# Altium project InsaneKeyboardRight.PrjPcb (part 2 of 3)
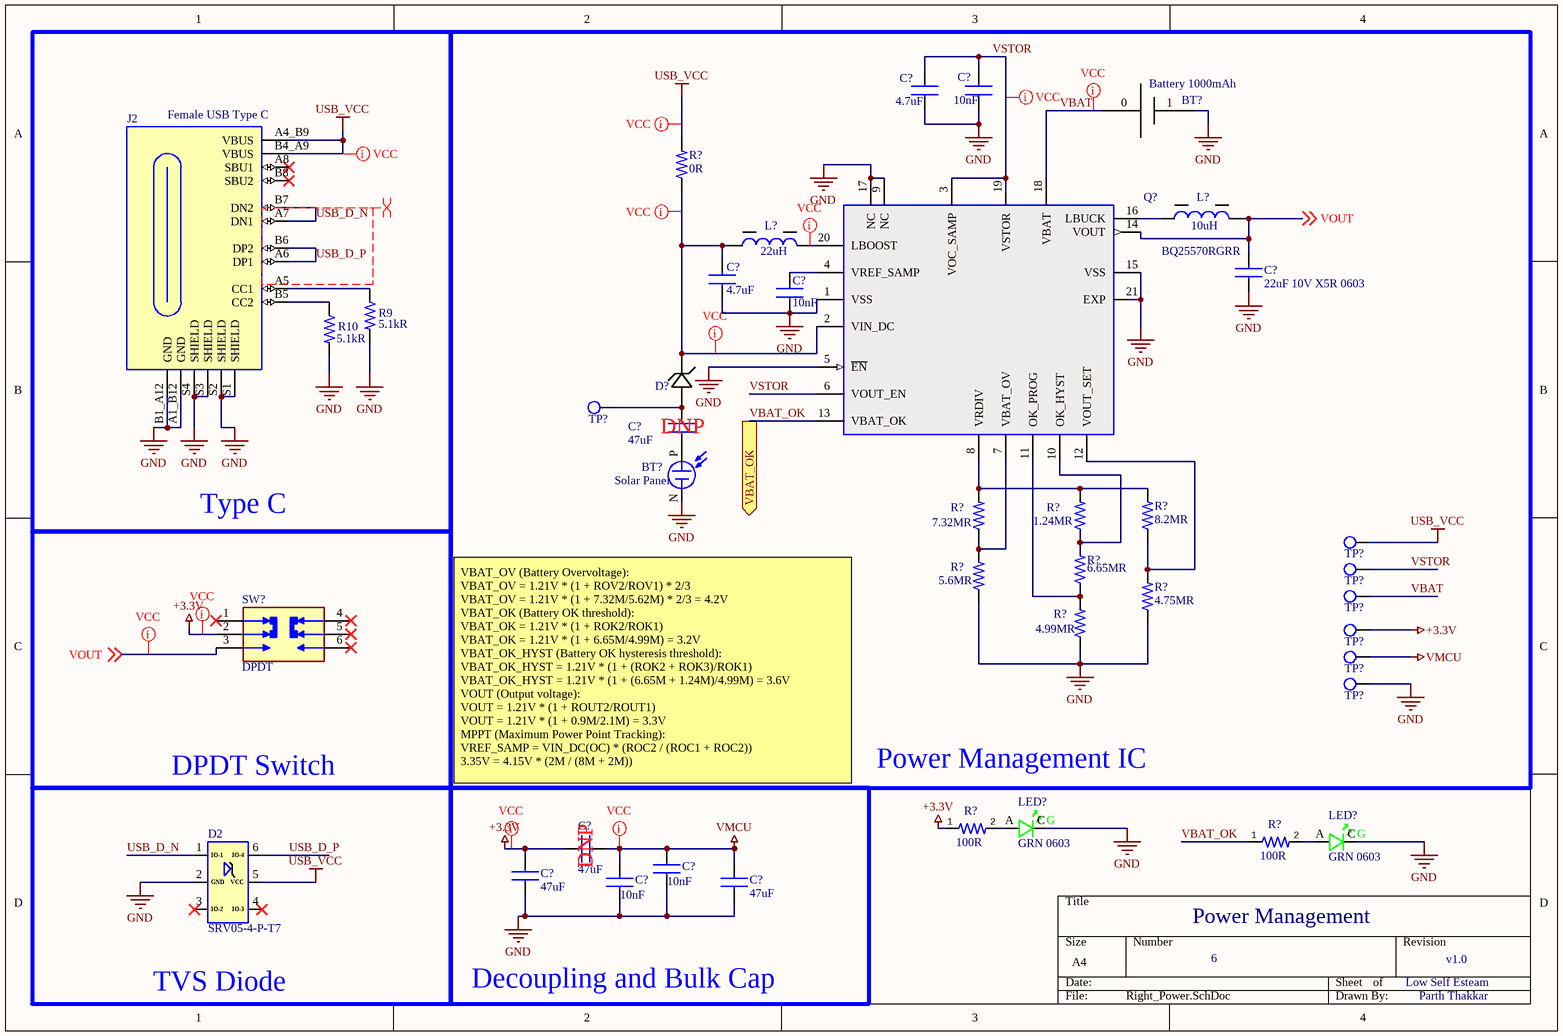
[diagram p5: Right_Power.SchDoc]

## Sheet Right_Power.SchDoc: Power Management (continued)
### Library data of the parts
BT?#1 = Battery 1000mAh: Batt Lith-ion 3.7V 1.05AH 404852; pin to pad: 0>1 1>3; Manufacturer: GlobTek; Manufacturer Part Number: BL1200P4054481S1PCAC; Supplier: Digikey; Supplier Part Number: 1939-BL1200P4054481S1PCAC-ND; RoHS: No; Category: Batteries and Accessories; Stock: 781; Pricing: 1=10.53, 10=9.312 (USD); ComponentLink1URL: https://www.globtek.com/pdf/manual-datasheets/BL1200P4054481S1PCAC.pdf?src-supplier=Digikey; ComponentLink1Description: https://www.globtek.com/pdf/manual-datasheets/BL1200P4054481S1PCAC.pdf?src-supplier=Digikey
BT?#2 = Solar Panel: Monocryst Solar Cell 184MW 4.15V; Manufacturer: ANYSOLAR; Manufacturer Part Number: SM141K06L; Supplier: Digikey; Supplier Part Number: SM141K06L-ND; RoHS: No; Stock: 2115; Pricing: 1=6.3, 25=4.9996, 50=4.7572, 100=4.545, 250=4.242, 500=4.0299 (USD)
C?#1 C?#4 = CAP 4.7uF 25V 0603: Ceramic Capacitor, Multilayer, Ceramic, 25V, 10% +Tol, 10% -Tol, X5R, 15% TC, 4.7uF, Surface Mount, 0603; Manufacturer: Murata; Manufacturer Part Number: GRT188R61E475KE13D; Multilayer: Yes; Reference Standard: AEC-Q200; Supplier: Digikey; Supplier Part Number: 490-12328-1-ND; RoHS: Yes; Category: Ceramic Capacitors; Stock: 959263; Pricing: 1=0.19, 10=0.111, 50=0.0792, 100=0.0693, 500=0.05246, 1000=0.04721 (USD); Mounting Technology: Surface Mount; Pins: 2; Dielectric Material: Ceramic; Package Shape: Rectangular; Case/Package: 0603; Terminal Finish: Nickel; Min Operating Temperature: -55°C; Max Operating Temperature: 85°C; JESD-609 Code: e3; Capacitor Type: Ceramic; Tolerance  (fill in as +-): 10%; Packaging: Tape and Reel; Tolerance (fill in as +-): 10%; Rated DC Voltage (URdc): 25V; Temperature Characteristics Code: X5R; Termination: Wraparound; Reach SVHC Compliant: Yes; RoHS Compliant: Yes; ComponentLink1URL: https://psearch.en.murata.com:443/capacitor/product/GRT188R61E475KE13%23.pdf?src-supplier=IHS+Markit; ComponentLink1Description: https://psearch.en.murata.com:443/capacitor/product/GRT188R61E475KE13%23.pdf?src-supplier=IHS+Markit; ComponentLink2URL: http://www.farnell.com/datasheets/2165958.pdf?src-supplier=Farnell; ComponentLink2Description: http://www.farnell.com/datasheets/2165958.pdf?src-supplier=Farnell; ComponentLink3URL: http://search.murata.co.jp/Ceramy/image/img/A01X/G101/ENG/GRT188R61E475KE13-01.pdf?src-supplier=Digikey; ComponentLink3Description: http://search.murata.co.jp/Ceramy/image/img/A01X/G101/ENG/GRT188R61E475KE13-01.pdf?src-supplier=Digikey; ComponentLink4URL: https://datasheet.octopart.com/GRT188R61E475KE13D-Murata-datasheet-67697750.pdf?src-supplier=Newark; ComponentLink4Description: https://datasheet.octopart.com/GRT188R61E475KE13D-Murata-datasheet-67697750.pdf?src-supplier=Newark; ComponentLink5URL: http://www.farnell.com/datasheets/2165958.pdf?src-supplier=Element14; ComponentLink5Description: http://www.farnell.com/datasheets/2165958.pdf?src-supplier=Element14; ComponentLink6URL: https://datasheet.octopart.com/GRT188R61E475KE13D-Murata-datasheet-165579666.pdf?src-supplier=TME; ComponentLink6Description: https://datasheet.octopart.com/GRT188R61E475KE13D-Murata-datasheet-165579666.pdf?src-supplier=TME
C?#2 C?#5 = CAP 10nF 100V 0603: Ceramic Capacitor, Multilayer, Ceramic, 100V, 10% +Tol, 10% -Tol, X7R, 15% TC, 0.01uF, Surface Mount, 0603; Manufacturer: Murata; Manufacturer Part Number: GCM188R72A103KA37D; Multilayer: Yes; Reference Standard: AEC-Q200; Supplier: Digikey; Supplier Part Number: 490-4781-1-ND; RoHS: Yes; Category: Ceramic Capacitors; Stock: 6259212; Pricing: 1=0.1, 10=0.03, 50=0.0204, 100=0.0174, 500=0.0125, 1000=0.01097, 4000=0.00978, 8000=0.00881, 12000=0.00833, 20000=0.00779, 28000=0.00747, 40000=0.00716, 100000=0.0065, 200000=0.00638 (USD); Mounting Technology: Surface Mount; Pins: 2; Dielectric Material: Ceramic; Package Shape: Rectangular; Case/Package: 0603; Terminal Finish: Nickel; Min Operating Temperature: -55°C; Max Operating Temperature: 125°C; JESD-609 Code: e3; Capacitor Type: Ceramic; Tolerance  (fill in as +-): 10%; Package Style: SMTMeter; Packaging: Tape and Reel; Tolerance (fill in as +-): 10%; Rated DC Voltage (URdc): 100V; Temperature Characteristics Code: X7R; Termination: Wraparound; Length: 1.6mm; Width: 0.8mm; Height: 0.9mm; Reach SVHC Compliant: Yes; RoHS Compliant: Yes; ComponentLink1URL: https://psearch.en.murata.com:443/capacitor/product/GCM188R72A103KA37%23.pdf?src-supplier=IHS+Markit; ComponentLink1Description: https://psearch.en.murata.com:443/capacitor/product/GCM188R72A103KA37%23.pdf?src-supplier=IHS+Markit; ComponentLink2URL: https://datasheet.ciiva.com/132/product-132907.pdf?src-supplier=Digikey; ComponentLink2Description: https://datasheet.ciiva.com/132/product-132907.pdf?src-supplier=Digikey; ComponentLink3URL: https://datasheet.ciiva.com/132/product-132908.pdf?src-supplier=Digikey; ComponentLink3Description: https://datasheet.ciiva.com/132/product-132908.pdf?src-supplier=Digikey; ComponentLink4URL: https://datasheet.ciiva.com/132/product-132909.pdf?src-supplier=Digikey; ComponentLink4Description: https://datasheet.ciiva.com/132/product-132909.pdf?src-supplier=Digikey; ComponentLink5URL: https://datasheet.ciiva.com/11786/0900766b80ef92d0-11786108.pdf?src-supplier=Rs; ComponentLink5Description: https://datasheet.ciiva.com/11786/0900766b80ef92d0-11786108.pdf?src-supplier=Rs; ComponentLink6URL: https://datasheet.ciiva.com/16497/product-16497251.pdf?src-supplier=Future+Electronics; ComponentLink6Description: https://datasheet.ciiva.com/16497/product-16497251.pdf?src-supplier=Future+Electronics; ComponentLink7URL: https://datasheet.ciiva.com/18183/getdatasheetpartid-178890-18183651.pdf?src-supplier=Verical; ComponentLink7Description: https://datasheet.ciiva.com/18183/getdatasheetpartid-178890-18183651.pdf?src-supplier=Verical; ComponentLink8URL: https://datasheet.ciiva.com/11619/product-11619719.pdf?src-supplier=Avnet; ComponentLink8Description: https://datasheet.ciiva.com/11619/product-11619719.pdf?src-supplier=Avnet
C?#3 = CAP 22uF 6.3V 0603: Ceramic Capacitor, Multilayer, Ceramic, 6.3V, 20% +Tol, 20% -Tol, X5R, 15% TC, 22uF, Surface Mount, 0603; Manufacturer: Murata; Manufacturer Part Number: GRM188R61A226ME15D; Voltage Rating DC: 10 VDC; Brand: Murata Electronics; Type: Voltage and Temperature Derating Recommended Product; Unit Weight: 0.000222 oz; Multilayer: Yes; Supplier 1: Digi-Key; Supplier Part Number 1: 490-10476-1-ND; Stock 1: 849458; Pricing 1: 1=0.33, 10=0.226, 50=0.1506, 100=0.1279, 500=0.0903, 1000=0.079 (USD); Product Category: Multilayer Ceramic Capacitors MLCC - SMD/SMT; RoHS: True; Capacitance: 22 uF; Dielectric: X5R; Tolerance: 20 %; Case Code - in: 0603; Case Code - mm: 1608; Height: 0.8 mm; Maximum Operating Temperature: + 85 C; Minimum Operating Temperature: - 55 C; Product: General Type MLCCs; Series: GRM; Packaging: Reel; Length: 1.6 mm; Package / Case: 0603 (1608 metric); Factory Pack Quantity: 4000; Termination Style: SMD/SMT; Width: 0.8 mm; ComponentLink1URL: http://www.farnell.com/datasheets/2047978.pdf?src-supplier=Element14; ComponentLink1Description: http://www.farnell.com/datasheets/2047978.pdf?src-supplier=Element14; Supplier: Digikey; Supplier Part Number: 490-7612-2-ND; Category: Ceramic Capacitors; Stock: 350000; Pricing: 10000=0.03357, 20000=0.03118, 30000=0.02998, 50000=0.02865, 70000=0.02786, 100000=0.0271, 250000=0.02546 (USD); Mounting Technology: Surface Mount; Pins: 2; Dielectric Material: Ceramic; Package Shape: Rectangular; Case/Package: 0603; Terminal Finish: Nickel; Min Operating Temperature: -55°C; Max Operating Temperature: 85°C; JESD-609 Code: e3; Value: 22uF; Capacitor Type: Ceramic; Tolerance  (fill in as +-): 20%; Package Style: SMTMeter; Tolerance (fill in as +-): 20%; Rated DC Voltage (URdc): 6.3V; Temperature Characteristics Code: X5R; Termination: Wraparound; Reach SVHC Compliant: Yes; RoHS Compliant: Yes; ComponentLink2URL: https://datasheet.ciiva.com:443/pdfs/VipMasterIC/IC/MURE/MURE-S-A0004349797/MURE-S-A0004352371-1.pdf?src-supplier=IHS+Markit; ComponentLink2Description: https://datasheet.ciiva.com:443/pdfs/VipMasterIC/IC/MURE/MURE-S-A0004349797/MURE-S-A0004352371-1.pdf?src-supplier=IHS+Markit; ComponentLink3URL: https://datasheet.ciiva.com/29541/partnumbering-e-01-29541598.pdf?src-supplier=Digikey; ComponentLink3Description: https://datasheet.ciiva.com/29541/partnumbering-e-01-29541598.pdf?src-supplier=Digikey
C?#6 C?#7 C?#9 C?#11 = CAP 47uF 10V 0805: Multilayer Ceramic Capacitors MLCC - SMD/SMT 0805 47uF 10volts *Derate Voltage/Temp; Manufacturer: Murata; Manufacturer Part Number: GRM21BR61A476ME15K; Tolerance: 20%; Dielectric: X5R; Supplier: Digikey; Supplier Part Number: 490-GRM21BR61A476ME15KCT-ND; RoHS: Yes; Category: Ceramic Capacitors; Mounting Technology: Surface Mount; Case/Package: 0805; Case Code (Imperial): 0805; Case Code (Metric): 2012; Weight: 0.000335oz; Material: Ceramic; Min Operating Temperature: -55°C; Max Operating Temperature: 85°C; Packaging: Tape and Reel; Voltage Rating: 10V; Termination: SMD/SMT; Voltage Rating (DC): 10V; Package Quantity: 10000; Series: GRM; Height: 1.45mm; RoHS Compliant: Yes; ComponentLink1URL: http://www.mouser.com/ds/2/281/c02e-2905.pdf?src-supplier=Mouser; ComponentLink1Description: http://www.mouser.com/ds/2/281/c02e-2905.pdf?src-supplier=Mouser; ComponentLink2URL: https://www.murata.com/~/media/webrenewal/support/library/catalog/products/capacitor/mlcc/c02e.ashx?la=en-us&src-supplier=Digikey; ComponentLink2Description: https://www.murata.com/~/media/webrenewal/support/library/catalog/products/capacitor/mlcc/c02e.ashx?la=en-us&src-supplier=Digikey; ComponentLink3URL: http://psearch.en.murata.com/capacitor/product/GRM21BR61A476ME15%23.pdf?src-supplier=Avnet; ComponentLink3Description: http://psearch.en.murata.com/capacitor/product/GRM21BR61A476ME15%23.pdf?src-supplier=Avnet; ComponentLink4URL: https://datasheet.octopart.com/GRM21BR61A476ME15K-Murata-datasheet-155345080.pdf?src-supplier=Newark; ComponentLink4Description: https://datasheet.octopart.com/GRM21BR61A476ME15K-Murata-datasheet-155345080.pdf?src-supplier=Newark; ComponentLink5URL: https://datasheet.octopart.com/GRM21BR61A476ME15K-Murata-datasheet-141278181.pdf?src-supplier=Future+Electronics; ComponentLink5Description: https://datasheet.octopart.com/GRM21BR61A476ME15K-Murata-datasheet-141278181.pdf?src-supplier=Future+Electronics; ComponentLink6URL: https://datasheet.octopart.com/GRM21BR61A476ME15K-Murata-datasheet-155345080.pdf?src-supplier=Element14; ComponentLink6Description: https://datasheet.octopart.com/GRM21BR61A476ME15K-Murata-datasheet-155345080.pdf?src-supplier=Element14; ComponentLink7URL: https://datasheet.octopart.com/GRM21BR61A476ME15K-Murata-datasheet-165579666.pdf?src-supplier=TME; ComponentLink7Description: https://datasheet.octopart.com/GRM21BR61A476ME15K-Murata-datasheet-165579666.pdf?src-supplier=TME
  C?#6 C?#7: Stock: 143272; Pricing: 1=0.72, 10=0.435, 50=0.3216, 100=0.2864, 500=0.22636, 1000=0.20762, 2500=0.18771, 5000=0.17563 (USD)
  C?#9 C?#11: Stock: 143262; Pricing: 1=0.72, 10=0.435, 50=0.3216, 100=0.2864, 500=0.22636, 1000=0.20762, 2500=0.18771, 5000=0.17563, 10000=0.16563, 20000=0.15734, 30000=0.15317, 50000=0.14853 (USD)
C?#8 C?#10 = CAP 0.1uF 100V 0603: Ceramic Capacitor, Multilayer, Ceramic, 100V, 10% +Tol, 10% -Tol, X7R, 15% TC, 0.01uF, Surface Mount, 0603; Manufacturer: Murata; Manufacturer Part Number: GCM188R72A103KA37D; Multilayer: Yes; Reference Standard: AEC-Q200; Supplier: Digikey; Supplier Part Number: 490-4781-2-ND; RoHS: Yes; Category: Ceramic Capacitors; Stock: 6260000; Pricing: 4000=0.00978, 8000=0.00881, 12000=0.00833, 20000=0.00779, 28000=0.00747, 40000=0.00716, 100000=0.0065, 200000=0.00638 (USD); Mounting Technology: Surface Mount; Pins: 2; Dielectric Material: Ceramic; Package Shape: Rectangular; Case/Package: 0603; Terminal Finish: Nickel; Min Operating Temperature: -55°C; Max Operating Temperature: 125°C; JESD-609 Code: e3; Capacitor Type: Ceramic; Tolerance  (fill in as +-): 10%; Package Style: SMTMeter; Packaging: Tape and Reel; Tolerance (fill in as +-): 10%; Rated DC Voltage (URdc): 100V; Temperature Characteristics Code: X7R; Termination: Wraparound; Length: 1.6mm; Width: 0.8mm; Height: 0.9mm; Reach SVHC Compliant: Yes; RoHS Compliant: Yes; ComponentLink1URL: https://psearch.en.murata.com:443/capacitor/product/GCM188R72A103KA37%23.pdf?src-supplier=IHS+Markit; ComponentLink1Description: https://psearch.en.murata.com:443/capacitor/product/GCM188R72A103KA37%23.pdf?src-supplier=IHS+Markit; ComponentLink2URL: https://datasheet.ciiva.com/132/product-132907.pdf?src-supplier=Digikey; ComponentLink2Description: https://datasheet.ciiva.com/132/product-132907.pdf?src-supplier=Digikey; ComponentLink3URL: https://datasheet.ciiva.com/132/product-132908.pdf?src-supplier=Digikey; ComponentLink3Description: https://datasheet.ciiva.com/132/product-132908.pdf?src-supplier=Digikey; ComponentLink4URL: https://datasheet.ciiva.com/132/product-132909.pdf?src-supplier=Digikey; ComponentLink4Description: https://datasheet.ciiva.com/132/product-132909.pdf?src-supplier=Digikey; ComponentLink5URL: https://datasheet.ciiva.com/11786/0900766b80ef92d0-11786108.pdf?src-supplier=Rs; ComponentLink5Description: https://datasheet.ciiva.com/11786/0900766b80ef92d0-11786108.pdf?src-supplier=Rs; ComponentLink6URL: https://datasheet.ciiva.com/16497/product-16497251.pdf?src-supplier=Future+Electronics; ComponentLink6Description: https://datasheet.ciiva.com/16497/product-16497251.pdf?src-supplier=Future+Electronics; ComponentLink7URL: https://datasheet.ciiva.com/18183/getdatasheetpartid-178890-18183651.pdf?src-supplier=Verical; ComponentLink7Description: https://datasheet.ciiva.com/18183/getdatasheetpartid-178890-18183651.pdf?src-supplier=Verical; ComponentLink8URL: https://datasheet.ciiva.com/11619/product-11619719.pdf?src-supplier=Avnet; ComponentLink8Description: https://datasheet.ciiva.com/11619/product-11619719.pdf?src-supplier=Avnet
D2 = D_TVS_Diode: Trans Voltage Suppressor Diode, 300W, 5V V(RWM), Unidirectional, 1 Element, Silicon; Manufacturer: Semtech; Manufacturer Part Number: SRV05-4.TCT; Value: TVS DIODE 5.5V 6TSOP; Type: Basic; Package Body Material: Plastic; Min Breakdown Voltage: 6V; Clamping Voltage-Max: 12.5V; Number of Elements: 1; Time @ Peak Reflow Temperature-Max (s): 30s; Qualification Status: Not Qualified; MFR Part #: SRV05-4-P-T7; LCSC Part#: C85364; Datasheet: https://datasheet.lcsc.com/szlcsc/ProTek-Devices-SRV05-4-P-T7_C85364.pdf; Supplier: Digikey; Supplier Part Number: SRV05-4CT-ND; RoHS: Yes; Category: TVS Diodes; Stock: 366681; Pricing: 1=1.34, 10=0.903, 100=0.6313, 500=0.50952, 1000=0.46965 (USD); Pins: 6; Diode Element Material: SILICON; Package Shape: Rectangular; Terminal Finish: Tin; Min Operating Temperature: -55°C; Max Operating Temperature: 125°C; JESD-609 Code: e3; Polarity: Unidirectional; Diode Type: TRANS VOLTAGE SUPPRESSOR; JESD-30 Code: R-PDSO-G6; Non-rep Peak Rev Power Dis-Max: 300W; Package Style: SMALL OUTLINEMeter; Rep Pk Reverse Voltage-Max: 5V; Surface Mount: Yes; Technology: AVALANCHE; Terminal Form: Gull Wing; Terminal Position: DUAL; Moisture Sensitivity Level: 1; Peak Reflow Temperature (Cel): 260°C; Reach SVHC Compliant: Yes; RoHS Compliant: Yes; ComponentLink1URL: https://datasheet.ciiva.com:443/pdfs/VipMasterIC/IC/SEMT/SEMT-S-A0000304756/SEMT-S-A0000304756-1.pdf?src-supplier=IHS+Markit; ComponentLink1Description: https://datasheet.ciiva.com:443/pdfs/VipMasterIC/IC/SEMT/SEMT-S-A0000304756/SEMT-S-A0000304756-1.pdf?src-supplier=IHS+Markit; ComponentLink2URL: https://datasheet.ciiva.com/8029/srv05-4-8029973.pdf?src-supplier=Element14; ComponentLink2Description: https://datasheet.ciiva.com/8029/srv05-4-8029973.pdf?src-supplier=Element14; ComponentLink3URL: https://datasheet.ciiva.com/18065/getdatasheetpartid-93542-18065216.pdf?src-supplier=Verical; ComponentLink3Description: https://datasheet.ciiva.com/18065/getdatasheetpartid-93542-18065216.pdf?src-supplier=Verical; ComponentLink4URL: https://datasheet.ciiva.com/338/srv05-4-338860.pdf?src-supplier=Digikey; ComponentLink4Description: https://datasheet.ciiva.com/338/srv05-4-338860.pdf?src-supplier=Digikey; ComponentLink5URL: https://datasheet.ciiva.com/338/srv05-4-338861.pdf?src-supplier=Digikey; ComponentLink5Description: https://datasheet.ciiva.com/338/srv05-4-338861.pdf?src-supplier=Digikey; ComponentLink6URL: https://datasheet.ciiva.com/338/srv05-4-338862.pdf?src-supplier=Digikey; ComponentLink6Description: https://datasheet.ciiva.com/338/srv05-4-338862.pdf?src-supplier=Digikey; ComponentLink7URL: https://datasheet.ciiva.com/11193/srv05-4-11193639.pdf?src-supplier=Avnet; ComponentLink7Description: https://datasheet.ciiva.com/11193/srv05-4-11193639.pdf?src-supplier=Avnet; ComponentLink8URL: https://datasheet.ciiva.com/16396/srv05-4-16396600.pdf?src-supplier=Future+Electronics; ComponentLink8Description: https://datasheet.ciiva.com/16396/srv05-4-16396600.pdf?src-supplier=Future+Electronics
D? = Diode Schottky: Rectifier Diode, Schottky, 1 Phase, 1 Element, 1A, 15V V(RRM), Silicon, DO-214BA; Manufacturer: Microchip; Manufacturer Part Number: LSM115JE3/TR13; Value: 150pF; Element Configuration: 5460ElementConfiguration; Forward Voltage: 220mV; Max Forward Surge Current (Ifsm): 50A; Max Reverse Current: 10mA; Supplier: Digikey; Supplier Part Number: 150-LSM115JE3/TR13CT-ND; RoHS: Yes; Category: Rectifier Diodes; Stock: 87281; Pricing: 1=0.55, 100=0.5 (USD); Mounting Technology: 8Mount; Pins: 2NUMBER; Weight: 103.986051mg; Min Operating Temperature: -55°C; Max Operating Temperature: 100°C; Average Rectified Current: 1A; Forward Current: 1A; Packaging: 10Packaging; Max Repetitive Reverse Voltage (Vrrm): 15V; Max Reverse Voltage (DC): 15V; Peak Non-Repetitive Surge Current: 50A; Reverse Voltage: 15V; Reverse Voltage (DC): 15V; Height: 2.92mm; Radiation Hardening: 5898YesNo; Lead Free: 5697LeadFree; ComponentLink1URL: https://datasheet.octopart.com/LSM115JE3-TR13-Microchip-datasheet-175858636.pdf?src-supplier=microchipDIRECT; ComponentLink1Description: https://datasheet.octopart.com/LSM115JE3-TR13-Microchip-datasheet-175858636.pdf?src-supplier=microchipDIRECT; ComponentLink2URL: https://datasheet.octopart.com/LSM115JE3-TR13-Microchip-datasheet-175858635.pdf?src-supplier=Master+Electronics; ComponentLink2Description: https://datasheet.octopart.com/LSM115JE3-TR13-Microchip-datasheet-175858635.pdf?src-supplier=Master+Electronics
J2 = USB-C Power Connector: USB-C (USB TYPE-C) Receptacle Connector 24 (6+18 Dummy) Position Surface Mount, Right Angle; Through Hole; Manufacturer Part Number: USB4125-GF-A_REVA2; Package: None; Availability: Unavailable; Value: *; Price: None
L?#1 = IND 10uH 1111: General Purpose Inductor, 10uH, 30%, 1 Element, Ferrite-Core, SMD, 1111; Manufacturer: Wurth Electronics; Manufacturer Part Number: 744029100; Case/Size Code: 1111; DC Resistance (DCR): 470mR; Inductor Application: POWER INDUCTOR; Channels: 1; Max Current Rating: 750mA; Self Resonant Frequency: 40MHz; Shape/Size Description: RECTANGULAR PACKAGE; Shielding: Unshielded; Test Frequency: 100kHz; Package Height: 1.35mm; Package Length: 2.8mm; Supplier: Digikey; Supplier Part Number: 732-1091-1-ND; RoHS: Yes; Category: Fixed Inductors; Stock: 28863; Pricing: 1=1.5, 10=1.36, 50=1.18, 100=1.11, 500=1.02 (USD); Pins: 2; Core Material: Ferrite; Terminal Finish: Tin; Min Operating Temperature: -40°C; Max Operating Temperature: 125°C; Tolerance: 30%; Construction: Chip; Inductor Type: GENERAL PURPOSE INDUCTOR; Package Style: SMTMeter; Packaging: Tape and Reel; Surface Mount: Yes; Terminal Placement: Dual Ended; Termination: One Surface; JESD-609 Code: e3; Package Width: 2.8mm; Reach SVHC Compliant: Yes; RoHS Compliant: Yes; ComponentLink1URL: https://datasheet.ciiva.com:443/pdfs/VipMasterIC/IC/MIDC/MIDC-S-A0002801410/MIDC-S-A0002801335-1.pdf?src-supplier=IHS+Markit; ComponentLink1Description: https://datasheet.ciiva.com:443/pdfs/VipMasterIC/IC/MIDC/MIDC-S-A0002801410/MIDC-S-A0002801335-1.pdf?src-supplier=IHS+Markit; ComponentLink2URL: https://datasheet.ciiva.com/6700/744029100-6700264.pdf?src-supplier=Digikey; ComponentLink2Description: https://datasheet.ciiva.com/6700/744029100-6700264.pdf?src-supplier=Digikey; ComponentLink3URL: https://datasheet.ciiva.com/5975/69360-5975061.pdf?src-supplier=Farnell; ComponentLink3Description: https://datasheet.ciiva.com/5975/69360-5975061.pdf?src-supplier=Farnell; ComponentLink4URL: https://datasheet.ciiva.com/11802/0900766b80d7f1cc-11802020.pdf?src-supplier=Rs; ComponentLink4Description: https://datasheet.ciiva.com/11802/0900766b80d7f1cc-11802020.pdf?src-supplier=Rs; ComponentLink5URL: https://datasheet.ciiva.com/4961/744029100-81254-4961409.pdf?src-supplier=Mouser; ComponentLink5Description: https://datasheet.ciiva.com/4961/744029100-81254-4961409.pdf?src-supplier=Mouser; ComponentLink6URL: https://datasheet.ciiva.com/6700/744029100-6700266.pdf?src-supplier=Digikey; ComponentLink6Description: https://datasheet.ciiva.com/6700/744029100-6700266.pdf?src-supplier=Digikey; ComponentLink7URL: https://datasheet.ciiva.com/7892/69360-7892549.pdf?src-supplier=Element14; ComponentLink7Description: https://datasheet.ciiva.com/7892/69360-7892549.pdf?src-supplier=Element14; ComponentLink8URL: https://datasheet.ciiva.com/22702/69360-22702631.pdf?src-supplier=Element14; ComponentLink8Description: https://datasheet.ciiva.com/22702/69360-22702631.pdf?src-supplier=Element14
L?#2 = IND 22uH 1515: General Purpose Inductor, 22uH, 30%, 1 Element, Ferrite-Core, SMD, 1515; Manufacturer: Wurth Electronics; Manufacturer Part Number: 744031220; Case/Size Code: 1515; DC Resistance (DCR): 450mR; Inductor Application: POWER INDUCTOR; Channels: 1; Max Current Rating: 510mA; Shape/Size Description: RECTANGULAR PACKAGE; Shielding: Unshielded; Test Frequency: 100kHz; Self Resonant Frequency: 26MHz; Package Height: 1.65mm; Package Length: 3.8mm; Supplier: Digikey; Supplier Part Number: 732-1012-1-ND; RoHS: Yes; Category: Fixed Inductors; Stock: 7582; Pricing: 1=1.52, 10=1.481, 50=1.296, 100=1.185, 500=1.044, 1000=0.821, 2000=0.735 (USD); Pins: 2; Terminal Finish: Tin; Core Material: Ferrite; Min Operating Temperature: -40°C; Max Operating Temperature: 115°C; Tolerance: 30%; JESD-609 Code: e3; Construction: Chip; Inductor Type: GENERAL PURPOSE INDUCTOR; Package Style: SMTMeter; Packaging: Tape and Reel; Surface Mount: Yes; Terminal Placement: Dual Ended; Termination: One Surface; Package Width: 3.8mm; Reach SVHC Compliant: Yes; RoHS Compliant: Yes; ComponentLink1URL: https://datasheet.ciiva.com:443/pdfs/VipMasterIC/IC/MIDC/MIDC-S-A0002802410/MIDC-S-A0002802381-1.pdf?src-supplier=IHS+Markit; ComponentLink1Description: https://datasheet.ciiva.com:443/pdfs/VipMasterIC/IC/MIDC/MIDC-S-A0002802410/MIDC-S-A0002802381-1.pdf?src-supplier=IHS+Markit; ComponentLink2URL: https://datasheet.ciiva.com/4961/744031220-79613-4961173.pdf?src-supplier=Mouser; ComponentLink2Description: https://datasheet.ciiva.com/4961/744031220-79613-4961173.pdf?src-supplier=Mouser; ComponentLink3URL: https://datasheet.ciiva.com/11800/0900766b8079f7b9-11800353.pdf?src-supplier=Rs; ComponentLink3Description: https://datasheet.ciiva.com/11800/0900766b8079f7b9-11800353.pdf?src-supplier=Rs; ComponentLink4URL: https://datasheet.ciiva.com/7210/744031220-7210946.pdf?src-supplier=Newark; ComponentLink4Description: https://datasheet.ciiva.com/7210/744031220-7210946.pdf?src-supplier=Newark; ComponentLink5URL: https://datasheet.ciiva.com/1058/744031220-1058566.pdf?src-supplier=Digikey; ComponentLink5Description: https://datasheet.ciiva.com/1058/744031220-1058566.pdf?src-supplier=Digikey; ComponentLink6URL: https://datasheet.ciiva.com/1058/744031220-1058567.pdf?src-supplier=Digikey; ComponentLink6Description: https://datasheet.ciiva.com/1058/744031220-1058567.pdf?src-supplier=Digikey; ComponentLink7URL: https://datasheet.ciiva.com/14123/lp744031220-data-de-14123802.pdf?src-supplier=Distrelec; ComponentLink7Description: https://datasheet.ciiva.com/14123/lp744031220-data-de-14123802.pdf?src-supplier=Distrelec; ComponentLink8URL: https://datasheet.ciiva.com/7691/744031220-7691543.pdf?src-supplier=Element14; ComponentLink8Description: https://datasheet.ciiva.com/7691/744031220-7691543.pdf?src-supplier=Element14
LED?#1 LED?#2 = LED Green 0603: LED, 0603, GREEN, 430MCD, 520NM; Manufacturer: Wurth Electronics; Manufacturer Part Number: 150060GS75000; Dynamic Catalog: 0603 Rectangle with Flat Top Chip LEDs; 3D Model: SMCW_0603.igs / SMCW_0603.stp / SMCW_0603.wrl; Wavelength - Peak: 515nm; Voltage - Forward (Vf) (Typ): 3.2V; Current - Test: 20mA; Viewing Angle: 140°; Lens Type: Clear; Lens Style/Size: Rectangle with Flat Top, 1.1mm x 0.7mm; Other Names: 732-4971-2; Supplier 1: Digi-Key; Stock 1: 34964; Pricing 1: 1=0.14, 50=0.129, 100=0.11, 500=0.095 (USD); Standard Package: 4,000; Category: Optoelectronics; Family: LED Indication - Discrete; Series: WL-SMCW; Packaging: Tape & Reel (TR); Color: Green; Wavelength - Dominant: 520nm; Millicandela Rating: 430mcd; Package / Case: 0603 (1608 Metric); Size / Dimension: 1.60mm L x 0.80mm W; Height: 0.70mm; Mounting Type: Surface Mount; Online Catalog: 0603 Rectangle with Flat Top Chip LEDs; ComponentLink1URL: https://katalog.we-online.de/led/datasheet/150060GS75000.pdf?src-supplier=Digi-Key; ComponentLink1Description: https://katalog.we-online.de/led/datasheet/150060GS75000.pdf?src-supplier=Digi-Key; ComponentLink2URL: http://www.produktinfo.conrad.com/datenblaetter/750000-774999/759427-da-01-en-CHIPLED_0603_W_KL_GRUEN_150060GS75000.pdf?src-supplier=Conrad; ComponentLink2Description: http://www.produktinfo.conrad.com/datenblaetter/750000-774999/759427-da-01-en-CHIPLED_0603_W_KL_GRUEN_150060GS75000.pdf?src-supplier=Conrad; Supplier Part Number 1: 732-4971-1-ND
Q? = BQ25570RGRR: Power Supply Support Circuit, Adjustable, 1 Channel, PQCC20; Manufacturer: Texas Instruments; Package Body Material: Plastic; Adjustable Threshold: Yes; Number of Channels: 1; Max Supply Voltage: 5.1V; Min Supply Voltage: 100mV; Supplier: Digikey; Supplier Part Number: 296-39934-1-ND; Manufacturer Part Number: BQ25570RGRR; RoHS: Yes; Category: Battery Management; Stock: 9572; Pricing: 1=7.11, 10=6.421, 25=6.1224, 100=5.3161, 250=5.07716, 500=4.62918, 1000=4.03187 (USD); Case/Package: HVQCCN; Pins: 20; Package Shape: Square; Terminal Finish: Nickel; Min Operating Temperature: -40°C; Max Operating Temperature: 85°C; JESD-609 Code: e4; Throw Configuration: POWER SUPPLY SUPPORT CIRCUIT; Moisture Sensitivity Level: 2; Channels: 1; Package Style: CHIP CARRIER, HEAT SINK/SLUG, VERY THIN PROFILEMeter; Peak Reflow Temperature (Cel): 260°C; Surface Mount: Yes; Terminal Form: No Lead; Terminal Position: QUAD; Length: 3.5mm; Width: 3.5mm; Height - Seated (Max): 1mm; Terminal Pitch: 0.5mm; Temperature Grade: INDUSTRIAL; Reach SVHC Compliant: Yes; RoHS Compliant: Yes; ComponentLink1URL: https://www.ti.com:443/lit/ds/symlink/bq25570.pdf?src-supplier=IHS+Markit; ComponentLink1Description: https://www.ti.com:443/lit/ds/symlink/bq25570.pdf?src-supplier=IHS+Markit; ComponentLink2URL: https://datasheet.ciiva.com/29590/bq25570-29590060.pdf?src-supplier=Digikey; ComponentLink2Description: https://datasheet.ciiva.com/29590/bq25570-29590060.pdf?src-supplier=Digikey
R9 R10 = RES 5.1K 0603: Fixed Resistor, Metal Glaze/thick Film, 0.1W, 5100ohm, 75V, 1% +/-Tol, 100ppm/Cel, Surface Mount, 0603; Manufacturer: Yageo; Manufacturer Part Number: RC0603FR-075K1L; Additional Feature: LASER TRIMMABLE; Power: 100mW; Rated Temperature: 70°C; Temperature Coefficient: 100ppm/°C; Package Height: 0.45mm; Package Length: 1.6mm; Package Width: 0.8mm; Supplier: Digikey; Supplier Part Number: 311-5.10KHRCT-ND; RoHS: Yes; Category: Chip SMD Resistors; Stock: 2084844; Pricing: 1=0.1, 10=0.019, 50=0.0112, 100=0.0093, 500=0.00622, 1000=0.00532, 5000=0.00382, 10000=0.00335, 25000=0.00287, 35000=0.00278, 50000=0.00257, 125000=0.00232 (USD); Mounting Technology: Surface Mount; Pins: 2; Package Shape: Rectangular; Case/Package: 0603; Terminal Finish: Nickel; Min Operating Temperature: -55°C; Max Operating Temperature: 155°C; Tolerance: 1%; JESD-609 Code: e3; Resistor Type: FIXED RESISTOR; Construction: Chip; Package Style: SMTMeter; Packaging: Tape and Reel; Technology: METAL GLAZE/THICK FILM; Termination: Wraparound; Working Voltage: 75V; Reach SVHC Compliant: Yes; RoHS Compliant: Yes; ComponentLink1URL: https://datasheet.ciiva.com:443/pdfs/VipMasterIC/IC/YAGO/YAGO-S-A0008145938/YAGO-S-A0008145938-1.pdf?src-supplier=IHS+Markit; ComponentLink1Description: https://datasheet.ciiva.com:443/pdfs/VipMasterIC/IC/YAGO/YAGO-S-A0008145938/YAGO-S-A0008145938-1.pdf?src-supplier=IHS+Markit; ComponentLink2URL: https://datasheet.ciiva.com/46395/443971-46395016.pdf?src-supplier=Element14; ComponentLink2Description: https://datasheet.ciiva.com/46395/443971-46395016.pdf?src-supplier=Element14; ComponentLink3URL: https://datasheet.ciiva.com/2454/pyu-r-int-thick-7-2454045.pdf?src-supplier=Digikey; ComponentLink3Description: https://datasheet.ciiva.com/2454/pyu-r-int-thick-7-2454045.pdf?src-supplier=Digikey; ComponentLink4URL: https://datasheet.ciiva.com/2454/pyu-r-int-thick-7-2454046.pdf?src-supplier=Digikey; ComponentLink4Description: https://datasheet.ciiva.com/2454/pyu-r-int-thick-7-2454046.pdf?src-supplier=Digikey; ComponentLink5URL: https://datasheet.ciiva.com/2454/pyu-r-int-thick-7-2454047.pdf?src-supplier=Digikey; ComponentLink5Description: https://datasheet.ciiva.com/2454/pyu-r-int-thick-7-2454047.pdf?src-supplier=Digikey; ComponentLink6URL: https://datasheet.ciiva.com/15189/getdatasheetpartid-326732-15189786.pdf?src-supplier=Verical; ComponentLink6Description: https://datasheet.ciiva.com/15189/getdatasheetpartid-326732-15189786.pdf?src-supplier=Verical
R?#9 = RES 0R 0402: Metal Glaze/thick Film, 0.0625W, 0ohm, Surface Mount, 0402; Manufacturer: Yageo; Manufacturer Part Number: RC0402JR-070RL; Power: 62.5mW; Rated Temperature: 70°C; Package Height: 0.35mm; Package Length: 1mm; Package Width: 0.5mm; Supplier: Digikey; Supplier Part Number: 311-0.0JRCT-ND; RoHS: Yes; Category: Chip SMD Resistors; Stock: 15179907; Pricing: 1=0.1, 10=0.011, 25=0.0084, 50=0.0064, 100=0.0045, 250=0.00364, 500=0.0029, 1000=0.00214, 5000=0.00154, 10000=0.00133, 30000=0.00117, 50000=0.00107, 100000=0.00105 (USD); Mounting Technology: Surface Mount; Pins: 2; Package Shape: Rectangular; Case/Package: 0402; Terminal Finish: Nickel; Min Operating Temperature: -55°C; Max Operating Temperature: 155°C; JESD-609 Code: e3; Resistor Type: FIXED RESISTOR; Construction: Chip; Package Style: SMTMeter; Packaging: Tape and Reel; Technology: METAL GLAZE/THICK FILM; Termination: Wraparound; Reach SVHC Compliant: Yes; RoHS Compliant: Yes; ComponentLink1URL: https://datasheet.ciiva.com:443/pdfs/VipMasterIC/IC/YAGO/YAGO-S-A0008145938/YAGO-S-A0008145938-1.pdf?src-supplier=IHS+Markit; ComponentLink1Description: https://datasheet.ciiva.com:443/pdfs/VipMasterIC/IC/YAGO/YAGO-S-A0008145938/YAGO-S-A0008145938-1.pdf?src-supplier=IHS+Markit; ComponentLink2URL: https://datasheet.ciiva.com/2452/pyu-rc0402-51-rohs-l-6-2452608.pdf?src-supplier=Digikey; ComponentLink2Description: https://datasheet.ciiva.com/2452/pyu-rc0402-51-rohs-l-6-2452608.pdf?src-supplier=Digikey; ComponentLink3URL: https://datasheet.ciiva.com/11808/0900766b80c66297-11808195.pdf?src-supplier=Rs; ComponentLink3Description: https://datasheet.ciiva.com/11808/0900766b80c66297-11808195.pdf?src-supplier=Rs; ComponentLink4URL: https://datasheet.ciiva.com/2452/pyu-r-int-thick-7-2452609.pdf?src-supplier=Digikey; ComponentLink4Description: https://datasheet.ciiva.com/2452/pyu-r-int-thick-7-2452609.pdf?src-supplier=Digikey; ComponentLink5URL: https://datasheet.ciiva.com/2452/pyu-r-int-thick-7-2452610.pdf?src-supplier=Digikey; ComponentLink5Description: https://datasheet.ciiva.com/2452/pyu-r-int-thick-7-2452610.pdf?src-supplier=Digikey; ComponentLink6URL: https://datasheet.ciiva.com/8896/pyu-rc0402-51-rohs-l-6-8896201.pdf?src-supplier=Avnet; ComponentLink6Description: https://datasheet.ciiva.com/8896/pyu-rc0402-51-rohs-l-6-8896201.pdf?src-supplier=Avnet; ComponentLink7URL: https://datasheet.ciiva.com/7983/1018594-7983535.pdf?src-supplier=Element14; ComponentLink7Description: https://datasheet.ciiva.com/7983/1018594-7983535.pdf?src-supplier=Element14; ComponentLink8URL: https://datasheet.ciiva.com/22747/1018594-22747515.pdf?src-supplier=Element14; ComponentLink8Description: https://datasheet.ciiva.com/22747/1018594-22747515.pdf?src-supplier=Element14
R?#10 = RES 7.32M 0603: Fixed Resistor, Metal Glaze/thick Film, 0.1W, 7320000ohm, 75V, 1% +/-Tol, 100ppm/Cel, Surface Mount, 0603; Manufacturer: Yageo; Manufacturer Part Number: RC0402FR-077M32L; Additional Feature: LASER TRIMMABLE; Power: 62.5mW; Rated Temperature: 70°C; Temperature Coefficient: 100ppm/°C; Working Voltage: 50V; Package Height: 0.35mm; Package Length: 1mm; Package Width: 0.5mm; Reference Standard: AEC-Q200; Supplier: Digikey; Supplier Part Number: 13-RC0402FR-077M32LCT-ND; RoHS: Yes; Category: Chip SMD Resistors; Stock: 49586; Pricing: 1=0.1, 10=0.015, 50=0.0088, 100=0.0073, 500=0.00488, 1000=0.00417, 5000=0.00297 (USD); Mounting Technology: Surface Mount; Pins: 2; Package Shape: Rectangular; Case/Package: 0402; Terminal Finish: Nickel; Min Operating Temperature: -55°C; Max Operating Temperature: 155°C; Tolerance: 1%; JESD-609 Code: e3; Resistor Type: FIXED RESISTOR; Construction: Chip; Package Style: SMTMeter; Packaging: Tape and Reel; Technology: METAL GLAZE/THICK FILM; Termination: Wraparound; Reach SVHC Compliant: Yes; RoHS Compliant: Yes; ComponentLink1URL: https://datasheet.ciiva.com:443/pdfs/VipMasterIC/IC/YAGO/YAGO-S-A0008145938/YAGO-S-A0008145938-1.pdf?src-supplier=IHS+Markit; ComponentLink1Description: https://datasheet.ciiva.com:443/pdfs/VipMasterIC/IC/YAGO/YAGO-S-A0008145938/YAGO-S-A0008145938-1.pdf?src-supplier=IHS+Markit; ComponentLink2URL: http://www.mouser.com/ds/2/447/PYu-RC0402_51_RoHS_L_6_r-8721.pdf?src-supplier=Mouser; ComponentLink2Description: http://www.mouser.com/ds/2/447/PYu-RC0402_51_RoHS_L_6_r-8721.pdf?src-supplier=Mouser; ComponentLink3URL: http://www.yageo.com.tw/exep/pages/download/literatures/PYu-R_INT-thick_7.pdf?src-supplier=Digikey; ComponentLink3Description: http://www.yageo.com.tw/exep/pages/download/literatures/PYu-R_INT-thick_7.pdf?src-supplier=Digikey; ComponentLink4URL: http://www.yageo.com/documents/recent/PYu-RC0402_51_RoHS_L_6.pdf?src-supplier=Avnet; ComponentLink4Description: http://www.yageo.com/documents/recent/PYu-RC0402_51_RoHS_L_6.pdf?src-supplier=Avnet; ComponentLink5URL: https://datasheet.octopart.com/RC0402FR-077M32L-Yageo-datasheet-164759695.pdf?src-supplier=Future+Electronics; ComponentLink5Description: https://datasheet.octopart.com/RC0402FR-077M32L-Yageo-datasheet-164759695.pdf?src-supplier=Future+Electronics; ComponentLink6URL: https://datasheet.ciiva.com:443/pdfs/VipMasterIC/IC/VISH/VISH-S-A0007266705/VISH-S-A0007266705-1.pdf?src-supplier=IHS+Markit; ComponentLink6Description: https://datasheet.ciiva.com:443/pdfs/VipMasterIC/IC/VISH/VISH-S-A0007266705/VISH-S-A0007266705-1.pdf?src-supplier=IHS+Markit; ComponentLink7URL: https://datasheet.ciiva.com/22676/1700796-22676479.pdf?src-supplier=Element14; ComponentLink7Description: https://datasheet.ciiva.com/22676/1700796-22676479.pdf?src-supplier=Element14; ComponentLink8URL: https://datasheet.ciiva.com/5588/dcrcwe3-109170-5588998.pdf?src-supplier=Mouser; ComponentLink8Description: https://datasheet.ciiva.com/5588/dcrcwe3-109170-5588998.pdf?src-supplier=Mouser; ComponentLink9URL: https://datasheet.ciiva.com/2525/dcrcwe3-2525464.pdf?src-supplier=Digikey; ComponentLink9Description: https://datasheet.ciiva.com/2525/dcrcwe3-2525464.pdf?src-supplier=Digikey; ComponentLink10URL: https://datasheet.ciiva.com/2525/dcrcwe3-2525465.pdf?src-supplier=Digikey; ComponentLink10Description: https://datasheet.ciiva.com/2525/dcrcwe3-2525465.pdf?src-supplier=Digikey; ComponentLink11URL: https://datasheet.ciiva.com/2525/dcrcwe3-2525466.pdf?src-supplier=Digikey; ComponentLink11Description: https://datasheet.ciiva.com/2525/dcrcwe3-2525466.pdf?src-supplier=Digikey
R?#11 = RES 1.24M 0603: Fixed Resistor, Metal Glaze/thick Film, 0.1W, 1240000ohm, 75V, 1% +/-Tol, 100ppm/Cel, Surface Mount, 0603; Manufacturer: Yageo; Manufacturer Part Number: RC0603FR-071M24L; Additional Feature: LASER TRIMMABLE; Power: 100mW; Rated Temperature: 70°C; Temperature Coefficient: 100ppm/°C; Package Height: 0.45mm; Package Length: 1.6mm; Package Width: 0.8mm; Supplier: Digikey; Supplier Part Number: 13-RC0603FR-071M24LCT-ND; RoHS: Yes; Category: Chip SMD Resistors; Stock: 7097; Pricing: 1=0.1, 10=0.019, 50=0.0112, 100=0.0093, 500=0.00622, 1000=0.00532 (USD); Mounting Technology: Surface Mount; Pins: 2; Package Shape: Rectangular; Case/Package: 0603; Terminal Finish: Nickel; Min Operating Temperature: -55°C; Max Operating Temperature: 155°C; Tolerance: 1%; JESD-609 Code: e3; Resistor Type: FIXED RESISTOR; Construction: Chip; Package Style: SMTMeter; Packaging: Tape and Reel; Technology: METAL GLAZE/THICK FILM; Termination: Wraparound; Working Voltage: 75V; Reach SVHC Compliant: Yes; RoHS Compliant: Yes; ComponentLink1URL: https://datasheet.ciiva.com:443/pdfs/VipMasterIC/IC/YAGO/YAGO-S-A0008145938/YAGO-S-A0008145938-1.pdf?src-supplier=IHS+Markit; ComponentLink1Description: https://datasheet.ciiva.com:443/pdfs/VipMasterIC/IC/YAGO/YAGO-S-A0008145938/YAGO-S-A0008145938-1.pdf?src-supplier=IHS+Markit; ComponentLink2URL: http://www.mouser.com/ds/2/447/RC0603-272842.pdf?src-supplier=Mouser; ComponentLink2Description: http://www.mouser.com/ds/2/447/RC0603-272842.pdf?src-supplier=Mouser; ComponentLink3URL: http://www.yageo.com/documents/recent/PYu-RC_Group_51_RoHS_L_2.pdf?src-supplier=Avnet; ComponentLink3Description: http://www.yageo.com/documents/recent/PYu-RC_Group_51_RoHS_L_2.pdf?src-supplier=Avnet; ComponentLink4URL: http://www.yageo.com.tw/exep/pages/download/literatures/PYu-R_INT-thick_7.pdf?src-supplier=Digikey; ComponentLink4Description: http://www.yageo.com.tw/exep/pages/download/literatures/PYu-R_INT-thick_7.pdf?src-supplier=Digikey; ComponentLink5URL: https://datasheet.octopart.com/RC0603FR-071M24L-Yageo-datasheet-164759695.pdf?src-supplier=Future+Electronics; ComponentLink5Description: https://datasheet.octopart.com/RC0603FR-071M24L-Yageo-datasheet-164759695.pdf?src-supplier=Future+Electronics
R?#12 = RES 8.2M 0603: Fixed Resistor, Metal Glaze/thick Film, 0.1W, 8200000ohm, 75V, 5% +/-Tol, 100ppm/Cel, Surface Mount, 0603; Manufacturer: Yageo; Manufacturer Part Number: RC0603JR-078M2L; Additional Feature: LASER TRIMMABLE; Power: 100mW; Rated Temperature: 70°C; Temperature Coefficient: 100ppm/°C; Package Height: 0.45mm; Package Length: 1.6mm; Package Width: 0.8mm; Supplier: Digikey; Supplier Part Number: 311-8.2MGRCT-ND; RoHS: Yes; Category: Chip SMD Resistors; Stock: 33026; Pricing: 1=0.1, 10=0.01, 50=0.0082, 100=0.0061, 500=0.0056, 1000=0.0051 (USD); Mounting Technology: Surface Mount; Pins: 2; Package Shape: Rectangular; Case/Package: 0603; Terminal Finish: Nickel; Min Operating Temperature: -55°C; Max Operating Temperature: 155°C; Tolerance: 5%; JESD-609 Code: e3; Resistor Type: FIXED RESISTOR; Construction: Chip; Package Style: SMTMeter; Packaging: Tape and Reel; Technology: METAL GLAZE/THICK FILM; Termination: Wraparound; Working Voltage: 75V; Reach SVHC Compliant: Yes; RoHS Compliant: Yes; ComponentLink1URL: https://datasheet.ciiva.com:443/pdfs/VipMasterIC/IC/YAGO/YAGO-S-A0008145938/YAGO-S-A0008145938-1.pdf?src-supplier=IHS+Markit; ComponentLink1Description: https://datasheet.ciiva.com:443/pdfs/VipMasterIC/IC/YAGO/YAGO-S-A0008145938/YAGO-S-A0008145938-1.pdf?src-supplier=IHS+Markit; ComponentLink2URL: https://datasheet.ciiva.com/12561/rc0603-272842-12561446.pdf?src-supplier=Mouser; ComponentLink2Description: https://datasheet.ciiva.com/12561/rc0603-272842-12561446.pdf?src-supplier=Mouser; ComponentLink3URL: https://datasheet.ciiva.com/2453/pyu-r-int-thick-7-2453229.pdf?src-supplier=Digikey; ComponentLink3Description: https://datasheet.ciiva.com/2453/pyu-r-int-thick-7-2453229.pdf?src-supplier=Digikey; ComponentLink4URL: https://datasheet.ciiva.com/2453/pyu-r-int-thick-7-2453230.pdf?src-supplier=Digikey; ComponentLink4Description: https://datasheet.ciiva.com/2453/pyu-r-int-thick-7-2453230.pdf?src-supplier=Digikey; ComponentLink5URL: https://datasheet.ciiva.com/2453/pyu-r-int-thick-7-2453231.pdf?src-supplier=Digikey; ComponentLink5Description: https://datasheet.ciiva.com/2453/pyu-r-int-thick-7-2453231.pdf?src-supplier=Digikey
R?#13 = RES 6.65M 0603: Fixed Resistor, Metal Glaze/thick Film, 0.1W, 6650000ohm, 75V, 1% +/-Tol, 100ppm/Cel, Surface Mount, 0603; Manufacturer: Vishay; Manufacturer Part Number: CRCW06036M65FKEA; Power: 100mW; Rated Temperature: 70°C; Temperature Coefficient: 100ppm/°C; Package Height: 0.45mm; Package Length: 1.55mm; Package Width: 0.85mm; Reference Standard: AEC-Q200; Supplier: Digikey; Supplier Part Number: 541-6.65MHCT-ND; RoHS: Yes; Category: Chip SMD Resistors; Stock: 29933; Pricing: 1=0.1, 10=0.026, 50=0.0166, 100=0.014, 500=0.00954, 1000=0.00824 (USD); Mounting Technology: Surface Mount; Pins: 2; Package Shape: Rectangular; Case/Package: 0603; Terminal Finish: Nickel; Min Operating Temperature: -55°C; Max Operating Temperature: 155°C; Tolerance: 1%; JESD-609 Code: e3; Resistor Type: FIXED RESISTOR; Construction: Chip; Package Style: SMTMeter; Packaging: Tape and Reel; Technology: METAL GLAZE/THICK FILM; Termination: Wraparound; Working Voltage: 75V; Reach SVHC Compliant: Yes; RoHS Compliant: Yes; ComponentLink1URL: https://datasheet.ciiva.com:443/pdfs/VipMasterIC/IC/VISH/VISH-S-A0007266705/VISH-S-A0007266705-1.pdf?src-supplier=IHS+Markit; ComponentLink1Description: https://datasheet.ciiva.com:443/pdfs/VipMasterIC/IC/VISH/VISH-S-A0007266705/VISH-S-A0007266705-1.pdf?src-supplier=IHS+Markit; ComponentLink2URL: https://datasheet.ciiva.com/2494/dcrcwe3-2494684.pdf?src-supplier=Digikey; ComponentLink2Description: https://datasheet.ciiva.com/2494/dcrcwe3-2494684.pdf?src-supplier=Digikey; ComponentLink3URL: https://datasheet.ciiva.com/2494/dcrcwe3-2494685.pdf?src-supplier=Digikey; ComponentLink3Description: https://datasheet.ciiva.com/2494/dcrcwe3-2494685.pdf?src-supplier=Digikey; ComponentLink4URL: https://datasheet.ciiva.com/2494/dcrcwe3-2494686.pdf?src-supplier=Digikey; ComponentLink4Description: https://datasheet.ciiva.com/2494/dcrcwe3-2494686.pdf?src-supplier=Digikey; ComponentLink5URL: https://datasheet.ciiva.com/9061/dcrcwe3-9061657.pdf?src-supplier=Avnet; ComponentLink5Description: https://datasheet.ciiva.com/9061/dcrcwe3-9061657.pdf?src-supplier=Avnet; ComponentLink6URL: https://datasheet.ciiva.com/7748/1697337-7748695.pdf?src-supplier=Element14; ComponentLink6Description: https://datasheet.ciiva.com/7748/1697337-7748695.pdf?src-supplier=Element14; ComponentLink7URL: https://datasheet.ciiva.com/7748/1697337-7748696.pdf?src-supplier=Element14; ComponentLink7Description: https://datasheet.ciiva.com/7748/1697337-7748696.pdf?src-supplier=Element14
R?#14 = RES 5.62M 0603: Fixed Resistor, Metal Glaze/thick Film, 0.1W, 5620000ohm, 75V, 1% +/-Tol, 100ppm/Cel, Surface Mount, 0603; Manufacturer: Yageo; Manufacturer Part Number: RC0603JR-075M6L; Tolerance: 5%; Additional Feature: LASER TRIMMABLE; Power: 100mW; Rated Temperature: 70°C; Temperature Coefficient: 100ppm/°C; Package Height: 0.45mm; Package Length: 1.6mm; Package Width: 0.8mm; Supplier: Digikey; Supplier Part Number: 311-5.6MGRCT-ND; RoHS: Yes; Category: Chip SMD Resistors; Stock: 110556; Pricing: 1=0.1, 10=0.015, 50=0.0092, 100=0.0076, 500=0.00512, 1000=0.00437 (USD); Mounting Technology: Surface Mount; Pins: 2; Package Shape: Rectangular; Case/Package: 0603; Terminal Finish: Nickel; Min Operating Temperature: -55°C; Max Operating Temperature: 155°C; JESD-609 Code: e3; Resistor Type: FIXED RESISTOR; Construction: Chip; Package Style: SMTMeter; Packaging: Tape and Reel; Technology: METAL GLAZE/THICK FILM; Termination: Wraparound; Working Voltage: 75V; Reach SVHC Compliant: Yes; RoHS Compliant: Yes; ComponentLink1URL: https://datasheet.ciiva.com:443/pdfs/VipMasterIC/IC/YAGO/YAGO-S-A0008145938/YAGO-S-A0008145938-1.pdf?src-supplier=IHS+Markit; ComponentLink1Description: https://datasheet.ciiva.com:443/pdfs/VipMasterIC/IC/YAGO/YAGO-S-A0008145938/YAGO-S-A0008145938-1.pdf?src-supplier=IHS+Markit; ComponentLink2URL: https://datasheet.ciiva.com/2453/pyu-r-int-thick-7-2453118.pdf?src-supplier=Digikey; ComponentLink2Description: https://datasheet.ciiva.com/2453/pyu-r-int-thick-7-2453118.pdf?src-supplier=Digikey; ComponentLink3URL: https://datasheet.ciiva.com/2453/pyu-r-int-thick-7-2453119.pdf?src-supplier=Digikey; ComponentLink3Description: https://datasheet.ciiva.com/2453/pyu-r-int-thick-7-2453119.pdf?src-supplier=Digikey; ComponentLink4URL: https://datasheet.ciiva.com/2453/pyu-r-int-thick-7-2453120.pdf?src-supplier=Digikey; ComponentLink4Description: https://datasheet.ciiva.com/2453/pyu-r-int-thick-7-2453120.pdf?src-supplier=Digikey; ComponentLink5URL: http://www.mouser.com/ds/2/447/RC0603-272842.pdf?src-supplier=Mouser; ComponentLink5Description: http://www.mouser.com/ds/2/447/RC0603-272842.pdf?src-supplier=Mouser; ComponentLink6URL: http://www.yageo.com/documents/recent/PYu-RC_Group_51_RoHS_L_2.pdf?src-supplier=Avnet; ComponentLink6Description: http://www.yageo.com/documents/recent/PYu-RC_Group_51_RoHS_L_2.pdf?src-supplier=Avnet; ComponentLink7URL: http://www.yageo.com.tw/exep/pages/download/literatures/PYu-R_INT-thick_7.pdf?src-supplier=Digikey; ComponentLink7Description: http://www.yageo.com.tw/exep/pages/download/literatures/PYu-R_INT-thick_7.pdf?src-supplier=Digikey
R?#15 = RES 4.75M 0603: Fixed Resistor, Metal Glaze/thick Film, 0.1W, 4750000ohm, 75V, 1% +/-Tol, 100ppm/Cel, Surface Mount, 0603; Manufacturer: Yageo; Manufacturer Part Number: RC0603FR-074M75L; Additional Feature: LASER TRIMMABLE; Power: 100mW; Rated Temperature: 70°C; Temperature Coefficient: 100ppm/°C; Package Height: 0.45mm; Package Length: 1.6mm; Package Width: 0.8mm; Supplier: Digikey; Supplier Part Number: 311-4.75MHRCT-ND; RoHS: Yes; Category: Chip SMD Resistors; Stock: 37378; Pricing: 1=0.1, 10=0.012, 50=0.0096, 100=0.0071, 500=0.00612, 1000=0.0051 (USD); Mounting Technology: Surface Mount; Pins: 2; Package Shape: Rectangular; Case/Package: 0603; Terminal Finish: Nickel; Min Operating Temperature: -55°C; Max Operating Temperature: 155°C; Tolerance: 1%; JESD-609 Code: e3; Resistor Type: FIXED RESISTOR; Construction: Chip; Package Style: SMTMeter; Packaging: Tape and Reel; Technology: METAL GLAZE/THICK FILM; Termination: Wraparound; Working Voltage: 75V; Reach SVHC Compliant: Yes; RoHS Compliant: Yes; ComponentLink1URL: https://datasheet.ciiva.com:443/pdfs/VipMasterIC/IC/YAGO/YAGO-S-A0008145938/YAGO-S-A0008145938-1.pdf?src-supplier=IHS+Markit; ComponentLink1Description: https://datasheet.ciiva.com:443/pdfs/VipMasterIC/IC/YAGO/YAGO-S-A0008145938/YAGO-S-A0008145938-1.pdf?src-supplier=IHS+Markit; ComponentLink2URL: https://datasheet.ciiva.com/2455/pyu-r-int-thick-7-2455038.pdf?src-supplier=Digikey; ComponentLink2Description: https://datasheet.ciiva.com/2455/pyu-r-int-thick-7-2455038.pdf?src-supplier=Digikey; ComponentLink3URL: https://datasheet.ciiva.com/2455/pyu-r-int-thick-7-2455039.pdf?src-supplier=Digikey; ComponentLink3Description: https://datasheet.ciiva.com/2455/pyu-r-int-thick-7-2455039.pdf?src-supplier=Digikey; ComponentLink4URL: https://datasheet.ciiva.com/2455/pyu-r-int-thick-7-2455040.pdf?src-supplier=Digikey; ComponentLink4Description: https://datasheet.ciiva.com/2455/pyu-r-int-thick-7-2455040.pdf?src-supplier=Digikey
R?#16 = RES 4.99M 0603: Fixed Resistor, Metal Glaze/thick Film, 0.1W, 4990000ohm, 75V, 1% +/-Tol, 100ppm/Cel, Surface Mount, 0603; Manufacturer: Yageo; Manufacturer Part Number: RC0603FR-074M99L; Additional Feature: LASER TRIMMABLE; Power: 100mW; Rated Temperature: 70°C; Temperature Coefficient: 100ppm/°C; Package Height: 0.45mm; Package Length: 1.6mm; Package Width: 0.8mm; Supplier: Digikey; Supplier Part Number: 13-RC0603FR-074M99LDKR-ND; RoHS: Yes; Category: Chip SMD Resistors; Stock: 585; Pricing: 1=0.1, 10=0.019, 50=0.0112, 100=0.0093, 500=0.00622, 1000=0.00532 (USD); Mounting Technology: Surface Mount; Pins: 2; Package Shape: Rectangular; Case/Package: 0603; Terminal Finish: Nickel; Min Operating Temperature: -55°C; Max Operating Temperature: 155°C; Tolerance: 1%; JESD-609 Code: e3; Resistor Type: FIXED RESISTOR; Construction: Chip; Package Style: SMTMeter; Packaging: Tape and Reel; Technology: METAL GLAZE/THICK FILM; Termination: Wraparound; Working Voltage: 75V; Reach SVHC Compliant: Yes; RoHS Compliant: Yes; ComponentLink1URL: https://datasheet.ciiva.com:443/pdfs/VipMasterIC/IC/YAGO/YAGO-S-A0008145938/YAGO-S-A0008145938-1.pdf?src-supplier=IHS+Markit; ComponentLink1Description: https://datasheet.ciiva.com:443/pdfs/VipMasterIC/IC/YAGO/YAGO-S-A0008145938/YAGO-S-A0008145938-1.pdf?src-supplier=IHS+Markit; ComponentLink2URL: http://www.mouser.com/ds/2/447/RC0603-272842.pdf?src-supplier=Mouser; ComponentLink2Description: http://www.mouser.com/ds/2/447/RC0603-272842.pdf?src-supplier=Mouser; ComponentLink3URL: http://www.yageo.com/documents/recent/PYu-RC_Group_51_RoHS_L_9.pdf?src-supplier=Digikey; ComponentLink3Description: http://www.yageo.com/documents/recent/PYu-RC_Group_51_RoHS_L_9.pdf?src-supplier=Digikey; ComponentLink4URL: http://www.yageo.com/documents/recent/PYu-RC0603_51_RoHS_L_7.pdf?src-supplier=Future+Electronics; ComponentLink4Description: http://www.yageo.com/documents/recent/PYu-RC0603_51_RoHS_L_7.pdf?src-supplier=Future+Electronics; ComponentLink5URL: http://www.yageo.com/documents/recent/PYu-RC_Group_51_RoHS_L_2.pdf?src-supplier=Avnet; ComponentLink5Description: http://www.yageo.com/documents/recent/PYu-RC_Group_51_RoHS_L_2.pdf?src-supplier=Avnet; ComponentLink6URL: https://datasheet.octopart.com/RC0603FR-074M99L-Yageo-datasheet-164759695.pdf?src-supplier=Future+Electronics; ComponentLink6Description: https://datasheet.octopart.com/RC0603FR-074M99L-Yageo-datasheet-164759695.pdf?src-supplier=Future+Electronics; ComponentLink7URL: https://datasheet.octopart.com/RC0603FR-074M99L-Yageo-datasheet-148775077.pdf?src-supplier=TME; ComponentLink7Description: https://datasheet.octopart.com/RC0603FR-074M99L-Yageo-datasheet-148775077.pdf?src-supplier=TME